# Altium schematic sheet [01] - COVER PAGE.SchDoc: =title
size A3; DocumentNumber: 2; SheetNumber: 2; SheetTotal: 4
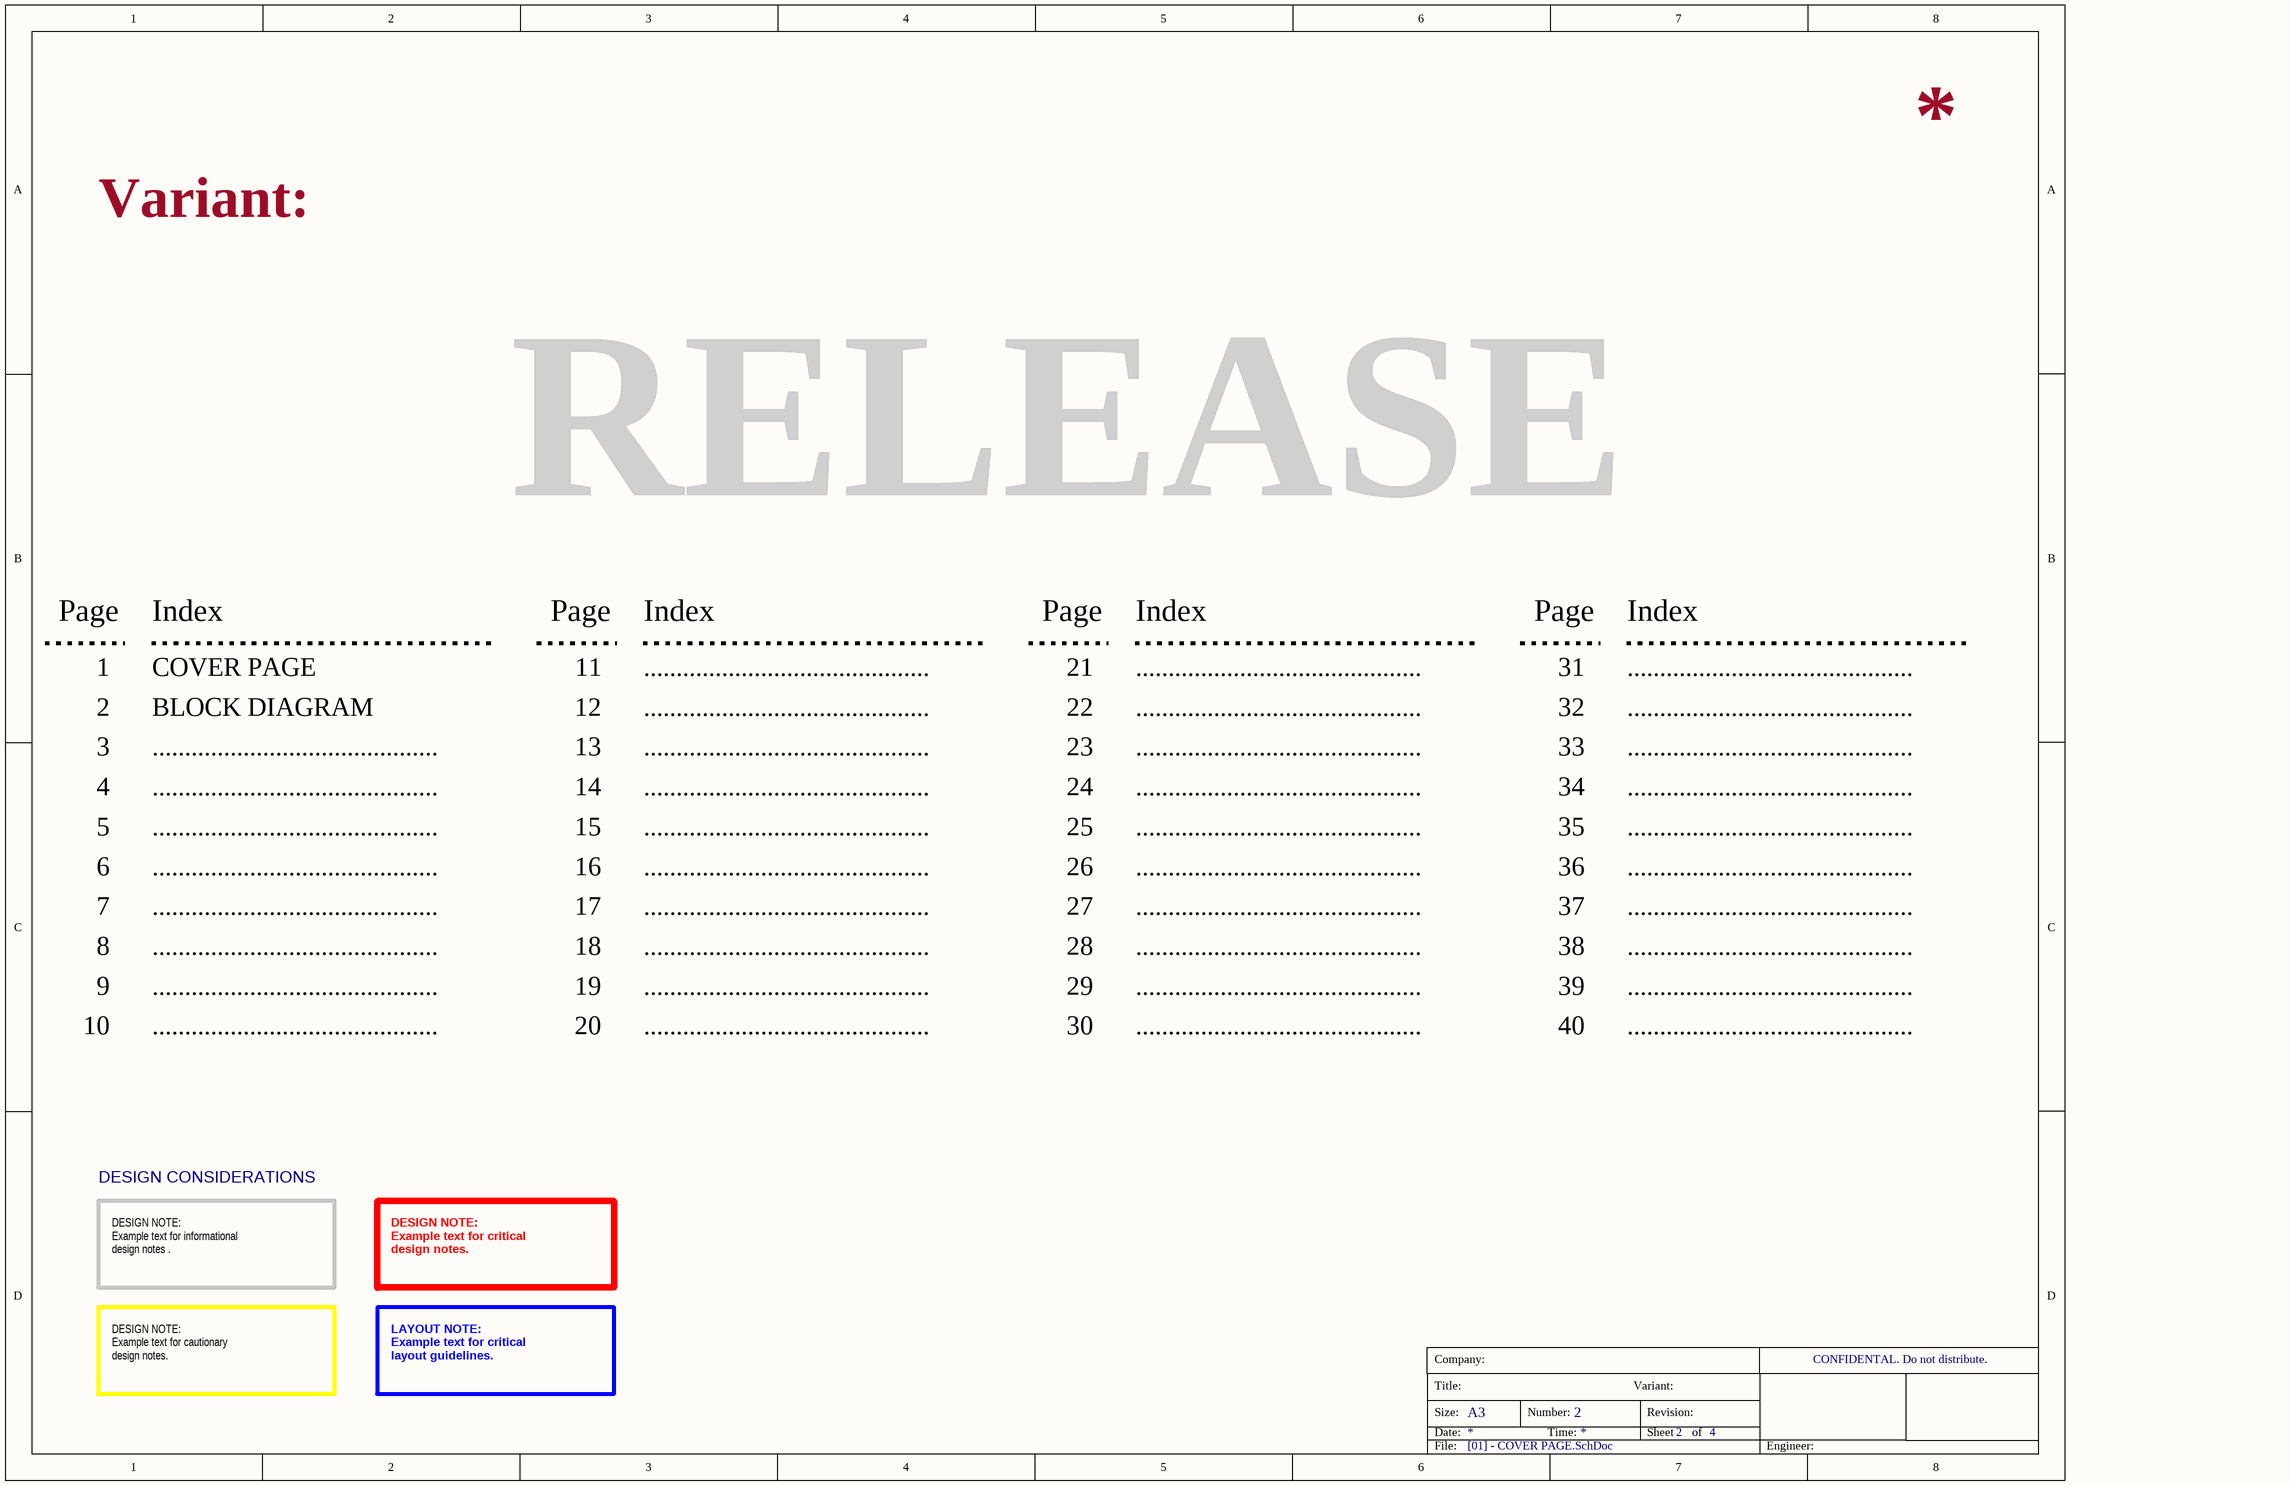
[diagram p0: [01] - COVER PAGE.SchDoc]

## Notes on the sheet
- Variant:
- RELEASE
- Page
- Index
- 1
- COVER PAGE
- 11
- ............................................
- 21
- 31
- 2
- 3
- BLOCK DIAGRAM
- 12
- 13
- 22
- 23
- 32
- 33
- 4
- 5
- 14
- 15
- 24
- 25
- 34
- 35
- 6
- 16
- 26
- 36
- 7
- 8
- 17
- 18
- 27
- 28
- 37
- 38
- 9
- 10
- 19
- 20
- 29
- 30
- 39
- 40
- DESIGN CONSIDERATIONS
- DESIGN NOTE:
  Example text for informational
  design notes .
- DESIGN NOTE:
  Example text for critical
  design notes.
- DESIGN NOTE:
  Example text for cautionary
  design notes.
- LAYOUT NOTE:
  Example text for critical
  layout guidelines.
- Company:
- CONFIDENTAL. Do not distribute.
- Title:
- Size:
- Date:
- A3
- Number:
- Time:
- Revision:
- Sheet
- of
- File:
- Engineer: